# Altium schematic sheet CATS-Vega-MCU.SchDoc: CATS Vega
size A4; DocumentNumber: Overview; Revision: V1.1; SheetNumber: 2; SheetTotal: 16; Author: Luca Jost; Subtitle: Microcontroller
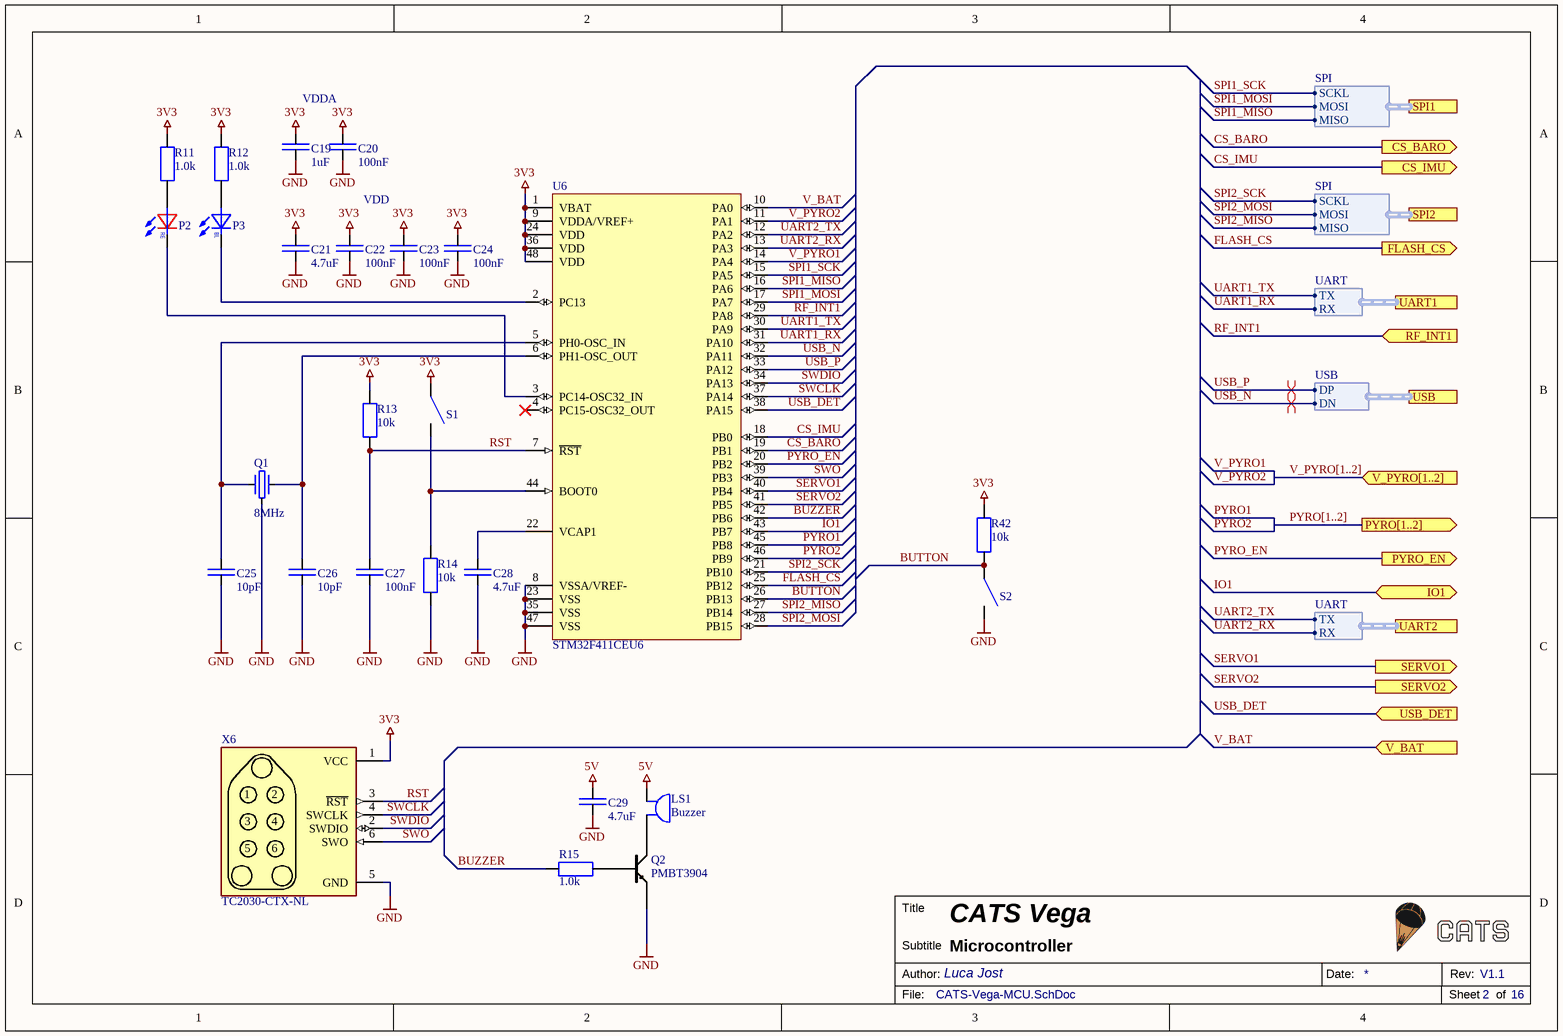
[diagram p0: CATS-Vega-MCU.SchDoc]

## Parts
C19  1uF  [SMD Keramikkondensator 0603]
C20  100nF  [SMD Keramikkondensator 0603]
C21  4.7uF  [SMD Keramikkondensator 0603]
C22  100nF  [SMD Keramikkondensator 0603]
C23  100nF  [SMD Keramikkondensator 0603]
C24  100nF  [SMD Keramikkondensator 0603]
C25  10pF  [SMD Keramikkondensator 0603]
C26  10pF  [SMD Keramikkondensator 0603]
C27  100nF  [SMD Keramikkondensator 0603]
C28  4.7uF  [SMD Keramikkondensator 0603]
C29  4.7uF  [SMD Keramikkondensator 0603]
LS1  Buzzer  [SMD BUZZER CMT-8504]
P2  LED  [SMD LED 0603]  (value not drawn)
P3  LED  [SMD LED 0603]  (value not drawn)
Q1  8MHz  [SMD Crystal 3.2X2.5X0.8]
Q2  PMBT3904  [SMD Transistor SOT-23]
R11  1.0k  [SMD Widerstand 0603]
R12  1.0k  [SMD Widerstand 0603]
R13  10k  [SMD Widerstand 0603]
R14  10k  [SMD Widerstand 0603]
R15  1.0k  [SMD Widerstand 0603]
R42  10k  [SMD Widerstand 0603]
S1  SMD-Button  [SMD Button 2.5x3x1.2]  (value not drawn)
S2  SMD-Button  [SMD Button 2.5x3x1.2]  (value not drawn)
U6  STM32F411CEU6  [SMD IC QFN-48]
X6  TC2030-CTX-NL  [SMD Connector TC2030]  (no BOM)

## Ports
CS_BARO (out), CS_IMU (out), FLASH_CS (out), IO1 (bidir), PYRO[1..2] (out), PYRO_EN (out), RF_INT1 (in), SERVO1 (out), SERVO2 (out), SPI1 (harness SPI), SPI2 (harness SPI), UART1 (harness UART), UART2 (harness UART), USB (harness USB), USB_DET (in), V_BAT (in), V_PYRO[1..2] (in)

## Harnesses
SPI: SCKL, MOSI, MISO
UART: TX, RX
USB: DP, DN

## Nets
3V3: C19.2 C20.2 C21.2 C22.2 C23.2 C24.2 R11.2 R12.2 R13.2 R42.2 S1.1 U6.1(VBAT) U6.9(VDDA/VREF+) U6.24(VDD) U6.36(VDD) U6.48(VDD) X6.1(VCC)
5V: C29.2 LS1.1
GND: C19.1 C20.1 C21.1 C22.1 C23.1 C24.1 C25.1 C26.1 C27.1 C28.1 C29.1 Q1.3 Q2.E R14.1 S2.2 U6.8(VSSA/VREF-) U6.23(VSS) U6.35(VSS) U6.47(VSS) X6.5(GND)
BUTTON: R42.1 S2.1 U6.26(PB13)
BUZZER: R15.2 U6.42(PB6)
CS_BARO: U6.19(PB1) ; port CS_BARO
CS_IMU: U6.18(PB0) ; port CS_IMU
FLASH_CS: U6.25(PB12) ; port FLASH_CS
IO1: U6.43(PB7) ; port IO1
PYRO1: U6.45(PB8)
PYRO2: U6.46(PB9)
PYRO_EN: U6.20(PB2) ; port PYRO_EN
RF_INT1: U6.29(PA8) ; port RF_INT1
RST: C27.2 R13.1 U6.7(~{RST}) X6.3(~{RST})
SERVO1: U6.40(PB4) ; port SERVO1
SERVO2: U6.41(PB5) ; port SERVO2
SPI1_MISO: U6.16(PA6) ; port SPI1.MISO
SPI1_MOSI: U6.17(PA7) ; port SPI1.MOSI
SPI1_SCK: U6.15(PA5) ; port SPI1.SCKL
SPI2_MISO: U6.27(PB14) ; port SPI2.MISO
SPI2_MOSI: U6.28(PB15) ; port SPI2.MOSI
SPI2_SCK: U6.21(PB10) ; port SPI2.SCKL
SWCLK: U6.37(PA14) X6.4(SWCLK)
SWDIO: U6.34(PA13) X6.2(SWDIO)
SWO: U6.39(PB3) X6.6(SWO)
UART1_RX: U6.31(PA10) ; port UART1.RX
UART1_TX: U6.30(PA9) ; port UART1.TX
UART2_RX: U6.13(PA3) ; port UART2.RX
UART2_TX: U6.12(PA2) ; port UART2.TX
USB_DET: U6.38(PA15) ; port USB_DET
USB_N: U6.32(PA11) ; port USB.DN
USB_P: U6.33(PA12) ; port USB.DP
V_BAT: U6.10(PA0) ; port V_BAT
V_PYRO1: U6.14(PA4)
V_PYRO2: U6.11(PA1)
NetC25_2: C25.2 Q1.1 U6.5(PH0-OSC_IN)
NetC26_2: C26.2 Q1.2 U6.6(PH1-OSC_OUT)
NetC28_2: C28.2 U6.22(VCAP1)
NetLS1_2: LS1.2 Q2.C
NetP2_A: P2.A R11.1
NetP2_K: P2.K U6.3(PC14-OSC32_IN)
NetP3_A: P3.A R12.1
NetP3_K: P3.K U6.2(PC13)
NetQ2_B: Q2.B R15.1
NetR14_2: R14.2 S1.2 U6.44(BOOT0)

Not connected (* = marked no-connect by the designer): U6 4(PC15-OSC32_OUT)*

## Buses and harness runs
bus PYRO[1..2] = port PYRO[1..2]
bus V_PYRO[1..2] = port V_PYRO[1..2]

## Layout directives
differential pair: USB_N, USB_P

## Notes on the sheet
- VDDA
- VDD
- Title
- Author:
- Subtitle
- Date:
- Rev:
- File:
- Sheet
- of
- (in symbol LED) BL; RE

## Library data of the parts
C19 = E6 - 1uF: SMD Ceramic Capacitor E6; Unit Price: 0.0047; JLC: C15849
C20 C22-C24 C27 = E6 - 100nF: SMD Ceramic Capacitor E6; Unit Price: 0.0024; JLC: C1591
C21 C28 C29 = E6 - 4.7uF: SMD Ceramic Capacitor E6; Unit Price: 0.0082; JLC: C19666
C25 C26 = E6 - 10pF: SMD Ceramic Capacitor E6; Unit Price: 0.0055; JLC: C1634
LS1 = Buzzer: Buzzers Indicator, Internally Driven Piezo 12V 10mA 3kHz 100dB @ 12V, 10cm Through Hole PC Pins; Digikey: 2603-CT08E-06S300-2TR-ND; ComponentLink1Description: Datasheet; ComponentLink1URL: https://datasheet.lcsc.com/lcsc/2001061407_INGHAi-GSC8530RA-16R2700_C255315.pdf; JLC: C255315; Unit Price: 0.4057
P2 P3 = LED: Color LED; Unit Price: 0.01
  P2: JLC: C84263
  P3: JLC: C434421
Q1 = Crystal: SMD Crystal Resonators 8MHz ±10ppm SMD,3.2x2.5mm; Digikey: 535-15255-1-ND; JLC: C2682775; ComponentLink1Description: Datasheet; ComponentLink1URL: https://datasheet.lcsc.com/lcsc/2106070434_Yangxing-Tech-X32258MOB4SI_C2682775.pdf; Mouser: 815-M8AIG-8-1ZT; Unit Price: 0.1431
Q2 = PMBT3904: 40 V, 200 mA NPN switching transisto; ComponentLink1Description: Datasheet; ComponentLink1URL: https://datasheet.lcsc.com/lcsc/2105201004_Nexperia-PMBT3904-215_C8667.pdf; JLC: C8667; Unit Price: 0.019
R11 R12 R15 = E24 - 1.0k: SMD Chip Resistor E24; Unit Price: 0.001; JLC: C2907113
R13 R14 R42 = E24 - 10k: SMD Chip Resistor E24; Unit Price: 0.001; JLC: C99198
S1 S2 = Button 3mmx2.5mm: Button SPST; Digikey: SW1020TR-ND; JLC: C128937; ComponentLink1Description: Datasheet; ComponentLink1URL: https://datasheet.lcsc.com/lcsc/2108131530_Korean-Hroparts-Elec-K2-1822SA-A3DW-06_C128937.pdf; Mouser: 653-B3U-1000P; Unit Price: 0.1654
U6 = STM32F411CEU6: ARM® Cortex®-M4 series Microcontroller IC 32-Bit 100MHz 512KB (512K x 8) FLASH 48-UFQFPN (7x7); Digikey: 497-14907-ND; JLC: C60420; ComponentLink1Description: Datasheet; ComponentLink1URL: https://datasheet.lcsc.com/lcsc/1809291612_STMicroelectronics-STM32F411CEU6_C60420.pdf; Unit Price: 5.0305
X6 = TC2030-CTX-NL: Tag-Connect for ARM-Cortex (6-Pin)